# EAGLE schematic Adafruit_PyRuler (EAGLE 9.4.1)
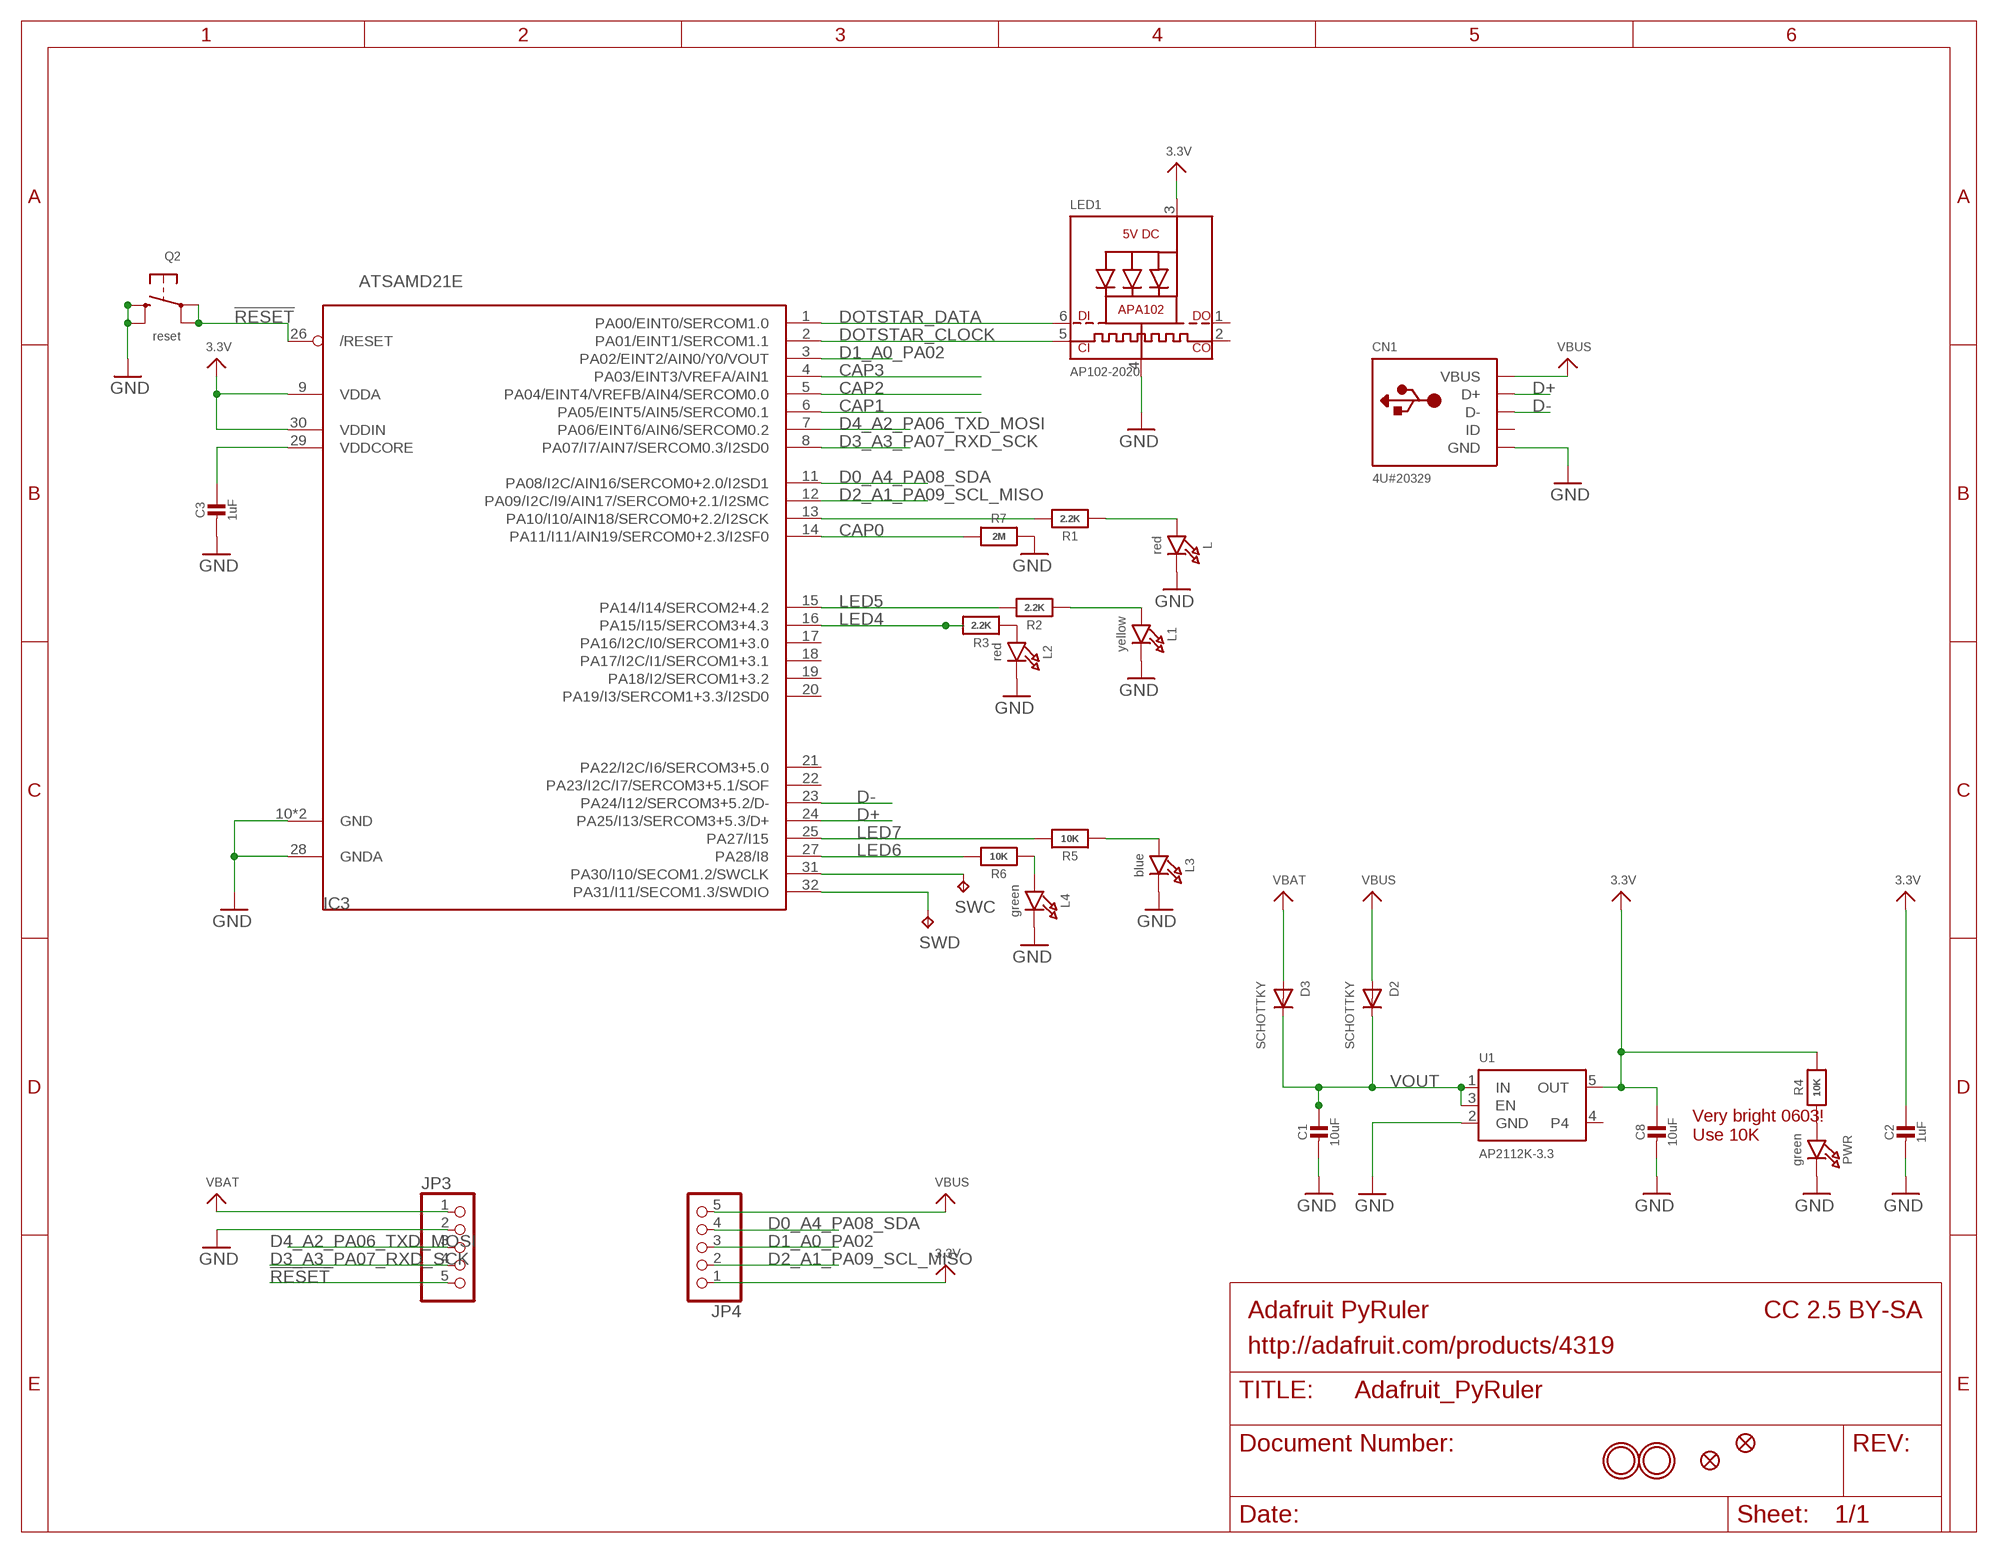
[diagram p0: schematic, sheet 1]

## Parts
C1  10uF  CAP_CERAMIC0805-NOOUTLINE  [0805-NO]
C2  1uF  CAP_CERAMIC0603_NO  [0603-NO]
C3  1uF  CAP_CERAMIC0603_NO  [0603-NO]
C8  10uF  CAP_CERAMIC0805-NOOUTLINE  [0805-NO]
CN1  4U#20329  USB_MICRO_NARROW  [4UCONN_20329_NARROW]
D2  SCHOTTKY  DIODE_SOD-123FL  [SOD-123FL]
D3  SCHOTTKY  DIODE_SOD-123FL  [SOD-123FL]
IC3  ATSAMD21E  [QFN32_5MM]
JP3  HEADER-1X570MIL  [1X05_ROUND_70]
JP4  HEADER-1X570MIL  [1X05_ROUND_70]
L  red  LED0603_NOOUTLINE  [CHIPLED_0603_NOOUTLINE]
L1  yellow  LED0603_NOOUTLINE  [CHIPLED_0603_NOOUTLINE]
L2  red  LED0603_NOOUTLINE  [CHIPLED_0603_NOOUTLINE]
L3  blue  LED0603_NOOUTLINE  [CHIPLED_0603_NOOUTLINE]
L4  green  LED0603_NOOUTLINE  [CHIPLED_0603_NOOUTLINE]
LED1  AP102-2020  APA1022020  [APA102_2020]
PWR  green  LED0603_NOOUTLINE  [CHIPLED_0603_NOOUTLINE]
Q2  reset  SWITCH_TACT_SMT4.6X2.8  [BTN_KMR2_4.6X2.8]
R1  2.2K  RESISTOR_0603_NOOUT  [0603-NO]
R2  2.2K  RESISTOR_0603_NOOUT  [0603-NO]
R3  2.2K  RESISTOR_0603_NOOUT  [0603-NO]
R4  10K  RESISTOR_0603_NOOUT  [0603-NO]
R5  10K  RESISTOR_0603_NOOUT  [0603-NO]
R6  10K  RESISTOR_0603_NOOUT  [0603-NO]
R7  2M  RESISTOR_0603_NOOUT  [0603-NO]
SWC  TPB1,27  [B1,27]
SWD  TPB1,27  [B1,27]
U1  AP2112K-3.3  VREG_SOT23-5  [SOT23-5]
U$1  FIDUCIAL_1MM  [FIDUCIAL_1MM]
U$6  FIDUCIAL_1MM  [FIDUCIAL_1MM]
U$8  MOUNTINGHOLE2.0  [MOUNTINGHOLE_2.0_PLATED]
U$9  MOUNTINGHOLE2.0  [MOUNTINGHOLE_2.0_PLATED]

## Nets
3.3V: C2.1 C8.1 IC3.9(VDDA) IC3.30(VDDIN) JP4.1 LED1.3(VDD) R4.2 U1.5(OUT)
!RESET: IC3.26(/RESET) JP3.5 Q2.A'(P1) Q2.A(P)
CAP0: IC3.14(PA11/I11/AIN19/SERCOM0+2.3/I2SF0) R7.1
CAP1: IC3.6(PA05/EINT5/AIN5/SERCOM0.1)
CAP2: IC3.5(PA04/EINT4/VREFB/AIN4/SERCOM0.0)
CAP3: IC3.4(PA03/EINT3/VREFA/AIN1)
D0_A4_PA08_SDA: IC3.11(PA08/I2C/AIN16/SERCOM0+2.0/I2SD1) JP4.4
D1_A0_PA02: IC3.3(PA02/EINT2/AIN0/Y0/VOUT) JP4.3
D2_A1_PA09_SCL_MISO: IC3.12(PA09/I2C/I9/AIN17/SERCOM0+2.1/I2SMC) JP4.2
D3_A3_PA07_RXD_SCK: IC3.8(PA07/I7/AIN7/SERCOM0.3/I2SD0) JP3.4
D4_A2_PA06_TXD_MOSI: IC3.7(PA06/EINT6/AIN6/SERCOM0.2) JP3.3
D+: CN1.D+ IC3.24(PA25/I13/SERCOM3+5.3/D+)
D-: CN1.D- IC3.23(PA24/I12/SERCOM3+5.2/D-)
DOTSTAR_CLOCK: IC3.2(PA01/EINT1/SERCOM1.1) LED1.5(CKI)
DOTSTAR_DATA: IC3.1(PA00/EINT0/SERCOM1.0) LED1.6(DI)
GND: C1.2 C2.2 C3.2 C8.2 CN1.BASE@1(GND) CN1.BASE@2(GND) CN1.GND CN1.SPRT@1(GND) CN1.SPRT@2(GND) CN1.SPRT@3(GND) CN1.SPRT@4(GND) IC3.10(GND) IC3.28(GNDA) IC3.33(GND) JP3.2 L1.C L2.C L3.C L4.C L.C LED1.4(GND) PWR.C Q2.B'(S1) Q2.B(S) R7.2 U1.2(GND)
LED: IC3.13(PA10/I10/AIN18/SERCOM0+2.2/I2SCK) R1.2
LED4: IC3.16(PA15/I15/SERCOM3+4.3) R3.2
LED5: IC3.15(PA14/I14/SERCOM2+4.2) R2.2
LED6: IC3.27(PA28/I8) R6.2
LED7: IC3.25(PA27/I15) R5.2
N$1: L.A R1.1
N$3: IC3.31(PA30/I10/SECOM1.2/SWCLK) SWC.TP
N$4: IC3.32(PA31/I11/SECOM1.3/SWDIO) SWD.TP
N$6: PWR.A R4.1
N$10: L1.A R2.1
N$11: L2.A R3.1
N$12: L4.A R6.1
N$13: L3.A R5.1
VBAT: D3.A JP3.1
VBUS: CN1.VBUS D2.A JP4.5
VDDCORE: C3.1 IC3.29(VDDCORE)
VOUT: C1.1 D2.C D3.C U1.1(IN) U1.3(EN)
Unconnected: CN1.ID IC3.17(PA16/I2C/I0/SERCOM1+3.0) IC3.18(PA17/I2C/I1/SERCOM1+3.1) IC3.19(PA18/I2/SERCOM1+3.2) IC3.20(PA19/I3/SERCOM1+3.3/I2SD0) IC3.21(PA22/I2C/I6/SERCOM3+5.0) IC3.22(PA23/I2C/I7/SERCOM3+5.1/SOF) LED1.1(DO) LED1.2(CKO) U1.4

## Notes on the sheet
- Very bright 0603!
  Use 10K
- Adafruit PyRuler | CC 2.5 BY-SA
- http://adafruit.com/products/4319

## Library data of the parts
C1-C3 C8 = microbuilder:CAP_CERAMIC: Ceramic Capacitors For new designs, use the packages preceded by an '_' character since they are more reliable: The following footprints should be used on most boards: _0402 - Standard footprint for regular board layouts _0603 - Standard footprint for regular board layouts _0805 - Standard footprint for regular board layouts _1206 - Standard footprint for regular board layouts For extremely tight-pitch boards where space is at a premium, the following 'micro-pitch' footprints can be used (smaller pads, no silkscreen outline, etc.): _0402MP - Micro-pitch footprint for very dense/compact boards _0603MP - Micro-pitch footprint for very dense/compact boards _0805MP - Micro-pitch footprint for very dense/compact boards _1206MP - Micro-pitch footprint for very dense/compact boards
CN1 = microbuilder:USB: USB Connectors USBMINIB - Surface Mount Female Mini-B USB Connector 4UConnector: 06564
D2 D3 = adafruit:DIODE: Diode SMADIODE - SMA Surface Mount Package 20V 1A Schottky Diode Digikey: 641-1014-6-ND DO-1N4148 - Through Hole Small Current Diode SOD-123 20V 1 A (.5mV Vf) Schottky Diode - Digikey: MBRX120TPMSCT-ND SOD-323 10V 570mA (.38mV Vf, 3ns) Schottky Diode - Digikey: ZLLS410CT-ND SOD-523 30V 30mA Schottky Diode (RB751S-40TE61) - Digikey: RB751S-40TE61CT-ND SOT23-R/W - SOT23 Package (R = Solder Paste/Reflow Ovens, W = Hand-Soldering) BAT54Film 40V 300mA - Digikey: 497-7162-1-ND
IC3 = microbuilder:ATSAMD21E
JP3 JP4 = microbuilder:HEADER-1X5: PIN HEADER
L L1-L4 PWR = microbuilder:LED: LED 0603 - 0603 Surface Mount Package 2mA: Green LED - Low Power (3.9mcd, 2ma, 1.7Vf) - Digikey: 475-2709-2-ND Orange LED - Low Power (9.8mcd, 2ma, 1.8Vf) - Digikey: 475-1194-2-ND Red LED - Low Power (5mcd, 2ma, 1.8Vf) - Digikey: 475-1195-2-ND Yellow LED - Low Power (7mcd, 2ma, 1.8Vf) - Digikey: 475-1196-2-ND 5mA: Blue LED - Low Power (17mcd, 5ma, 2.9Vf) - Digikey: LNJ937W8CRACT-ND 0805 - 0805 Surface Mount Package 2mA: Red LED (8.8mcd, 2mA, 1.8Vf, Clear) - Low Power [Digikey: 475-2510-1-ND] Green LED (5mcd, 2mA, 1.8Vf, Clear) - Low Power [Digikey: 475-2730-1-ND] Yellow LED (11.3mcd, 2mA, 1.8Vf, Clear) - Low Power [Digikey: 475-2555-1-ND] 20mA: Red LED (104mcd, 20mA, Diffused) - LS R976 [Digikey: 475-1278-6-ND] Red LED (12mcd, 20mA, 2.0Vf, Clear) - APT2012EC [Digikey: 754-1128-1-ND] Green LED (15mcd, 20mA, 2.2Vf, Clear) - APT2012GC [Digikey: 754-1131-1-ND] Orange LED (160mcd, 20mA, 2.1Vf, Clear) - APT2012SECK [Digikey: 754-1130-1-ND] 1206 - 1206 Surface Mount Package Green LED (26mcd, 20mA, Diffused) - LG N971 [Digikey: 475-1407-6-ND] Red LED (15mcd, 20mA, Diffused) - LH N974 [Digikey: 475-1416-6-ND] Cree - Cree High-Power Surface Mount LEDs XPEBWT-L1-0000-00D50 - White 111lm 350mA 2.9Vf 6200K 110° XTEAWT-00-0000-00000LEE3 - White 114lm 350mA 2.85Vf 5000K 115° Everlight - Everlight 45-21 Series Surface Mount LEDs 45-21/QK2C-B2832AC2CB2/2T - Warm White 2000mcd 20mA 3.25Vf 3050K 120° 45-21/LK2C-B38452C4CB2/2T - Nuetral White 2000mcd 20mA 3.25Vf 4150K 120° 45-21/LK2C-B50634C6CB2/2T - Cold White 2200mcd 20mA 3.25Vf 5650K 120° PLCC2 Reverse Mount LS T77K-J1L2-1-0-2-R18-Z - Red 11.25mcd 2mA 1.8Vf 630nm 120° LO T77K-L1M2-24-Z - Orange 19.6mcd 2mA 1.8Vf 606nm 120° LY T77K-K2M1-26-Z - Yellow 15.7mcd 2mA 1.8Vf 587nm 120°
LED1 = microbuilder:APA102: APA102/DotStar Pixels VCC: 5V DC Refresh Rate: 400Hz
Q2 = microbuilder:SWITCH_TACT_SMT: SMT Tact Switches 6x6mm - Digikey: P12940SCT-ND KMR2 (4.6x2.8mm) - Digikey: 401-1426-1-ND EVQ-PQHB55 - Light Touch, 160GF (4.5x4.5mm) - Digikey: P8090SCT-ND KMT0 - KMT021 NGJ LHS (etc.) IP68/Waterproof - Digikey: CKN10289CT-ND
R1-R7 = microbuilder:RESISTOR: Resistors For new designs, use the packages preceded by an '_' character since they are more reliable: The following footprints should be used on most boards: _0402 - Standard footprint for regular board layouts _0603 - Standard footprint for regular board layouts _0805 - Standard footprint for regular board layouts _1206 - Standard footprint for regular board layouts For extremely tight-pitch boards where space is at a premium, the following 'micro-pitch' footprints can be used (smaller pads, no silkscreen outline, etc.): _0402MP - Micro-pitch footprint for very dense/compact boards _0603MP - Micro-pitch footprint for very dense/compact boards _0805MP - Micro-pitch footprint for very dense/compact boards _1206MP - Micro-pitch footprint for very dense/compact boards
SWC SWD = testpad:TP: Test pad
U1 = microbuilder:VREG_SOT23-5: SOT23-5 Fixed Voltage Regulators Part Current Out V Out V In V Dropout θJA (°C/W) TJ (°C) Digikey Part No. ADP121 150mA 3.3V 3.4-5.5V 0.09V @ 150mA -- -- ADP121-AUJZ33R7CT-ND ADP121 150mA 3.0V 3.1-5.5V 0.09V @ 150mA -- -- ADP121-AUJZ30R7CT-ND ADP122 300mA 3.3V 3.4-5.5V 0.085V @ 300mA -- -- ADP122AUJZ-3.3-R7CT-ND ADP1712 300mA 3.3V 3.5-5.5V 0.17V @ 300mA -- -- ADP1712AUJZ-3.3-R7TR-ND AP7311 (Low Cost) 150mA 3.3V 3.5-6V 0.15V @ 150mA -- -- AP7311-33WG-7DICT-ND LD39015M18R 150mA 1.8V 1.9V-5.5V 0.08V @ 100mA -- -- 497-6977-1-ND LP2985A-33DBVR 150mA 3.3V 3.3-16V 0.28V @ 150mA 206 150 296-18479-1-ND MCP1824T-3302E/OT 300mA 3.3V 3.5V-6V 0.2V @ 300mA -- -- MCP1824T-3302E/OTCT-ND MIC5205-2.5YM5 TR 150mA 2.5V 2.7-16V 0.165V @ 150mA -- -- 576-1257-2-ND MIC5205-3.0YM5 TR 150mA 3.0V 3.2V-16V 0.165V @ 150mA -- -- 576-1258-2-ND MIC5205-3.3YM5 TR 150mA 3.3V 3.5V-16V 0.165V @ 150mA -- -- 576-1259-2-ND TPS780330220 150mA 3.3V+2.2V 3.6-5.5V 250mV Max -- -- 296-23332-1-ND TDA3663/N1,135 100mA 3.3V 3.5-45V 0.18V @ 50mA -- -- 568-5343-1-ND Max operating temp can be calculated using θJA, TJ (max junction temperature), and power in watts. Set the "Maximum Ambient Temperature" until it reaches TJ ("Max Junction Temperature"), which is the absolute limit for safe use of the regulator: Heat Sink Temperature Calculator <http://www.daycounter.com/Calculators/Heat-Sink-Temperature-Calculator.phtml> For example, With 12V source into a 3.3V LP2985 and a 30mA load, we are dissipating (12V-3.3V) * 0.03A = 0.261W. With a θJA of 206 °C/W, a TJ of 150°C, and 261mW we can safely use the chip without a heat sink up to 75°C (=147.1°C Junction Temperature).
U$1 U$6 = microbuilder:FIDUCIAL: Fiducial Alignment Points Various fiducial points for machine vision alignment.; BOM: EXCLUDE
U$8 U$9 = microbuilder:MOUNTINGHOLE: Mounting Hole For #2 screws (0.086"/2.18mm width, 0.094"/2.4mm hole) use 2.5mm; BOM: EXCLUDE